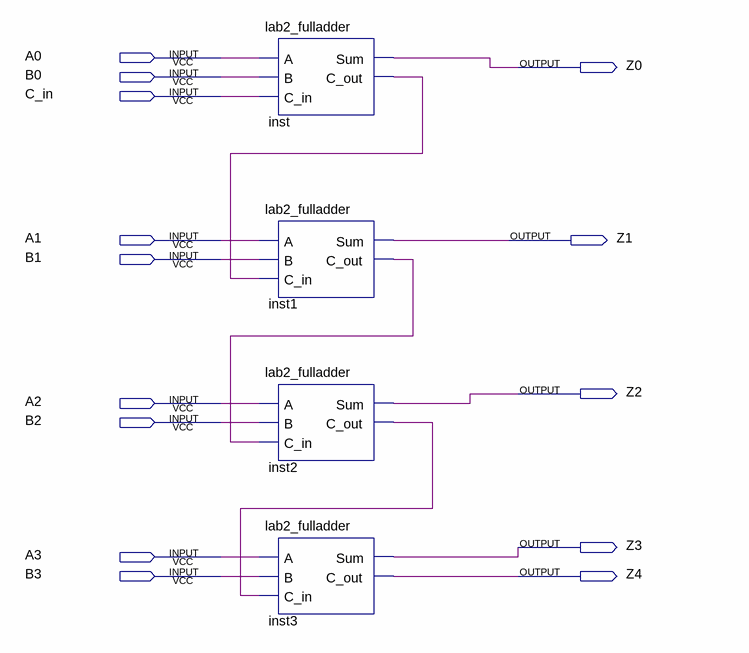
[diagram p0: schematic sheet]
// Quartus schematic lab2_block_schem.bdf as structural Verilog: 4 symbols, 14 pins
module lab2_block_schem (
  input  A0,
  input  B0,
  input  C_in,
  input  A1,
  input  B1,
  input  A2,
  input  B2,
  input  A3,
  input  B3,
  output Z0,
  output Z1,
  output Z2,
  output Z3,
  output Z4
);

  wire inst1_c_out, inst2_c_out, inst_c_out;

  lab2_fulladder inst (.A(A0), .B(B0), .C_in(C_in), .Sum(Z0), .C_out(inst_c_out));
  lab2_fulladder inst1 (.A(A1), .B(B1), .C_in(inst_c_out), .Sum(Z1), .C_out(inst1_c_out));
  lab2_fulladder inst2 (.A(A2), .B(B2), .C_in(inst1_c_out), .Sum(Z2), .C_out(inst2_c_out));
  lab2_fulladder inst3 (.A(A3), .B(B3), .C_in(inst2_c_out), .Sum(Z3), .C_out(Z4));
endmodule
